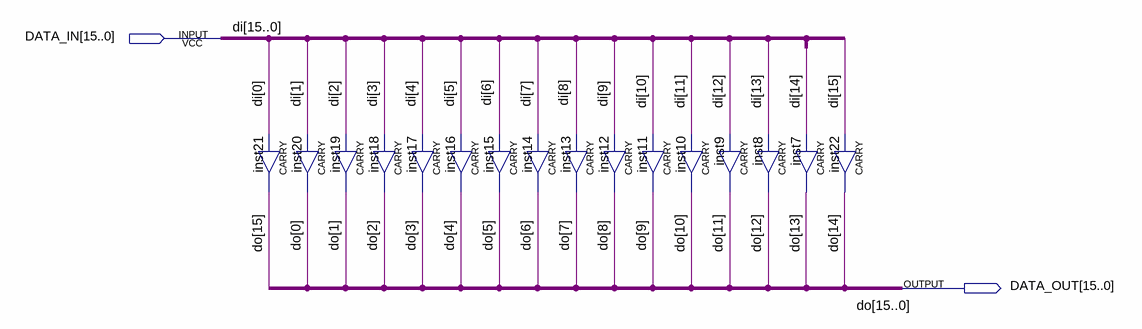
[diagram p0: schematic sheet]
// Quartus schematic oper_rol.bdf as structural Verilog: 16 symbols, 2 pins
module oper_rol (
  input  [15:0] DATA_IN,
  output [15:0] DATA_OUT
);

  CARRY inst21 (.IN(DATA_IN[0]), .OUT(DATA_OUT[15]));
  CARRY inst19 (.IN(DATA_IN[2]), .OUT(DATA_OUT[1]));
  CARRY inst20 (.IN(DATA_IN[1]), .OUT(DATA_OUT[0]));
  CARRY inst17 (.IN(DATA_IN[4]), .OUT(DATA_OUT[3]));
  CARRY inst18 (.IN(DATA_IN[3]), .OUT(DATA_OUT[2]));
  CARRY inst15 (.IN(DATA_IN[6]), .OUT(DATA_OUT[5]));
  CARRY inst16 (.IN(DATA_IN[5]), .OUT(DATA_OUT[4]));
  CARRY inst13 (.IN(DATA_IN[8]), .OUT(DATA_OUT[7]));
  CARRY inst14 (.IN(DATA_IN[7]), .OUT(DATA_OUT[6]));
  CARRY inst11 (.IN(DATA_IN[10]), .OUT(DATA_OUT[9]));
  CARRY inst12 (.IN(DATA_IN[9]), .OUT(DATA_OUT[8]));
  CARRY inst9 (.IN(DATA_IN[12]), .OUT(DATA_OUT[11]));
  CARRY inst10 (.IN(DATA_IN[11]), .OUT(DATA_OUT[10]));
  CARRY inst7 (.IN(DATA_IN[14]), .OUT(DATA_OUT[13]));
  CARRY inst8 (.IN(DATA_IN[13]), .OUT(DATA_OUT[12]));
  CARRY inst22 (.IN(DATA_IN[15]), .OUT(DATA_OUT[14]));

  // Other names for the same wires on the sheet: di[15:0] = DATA_IN; do[15:0] = DATA_OUT
endmodule
